# Altium schematic sheet EVB-ANNA-B5_SCHEM_0001_Power.SchDoc
size A3; Date: 7/24/2020; CompanyName: U-blox; DrawnBy: EMOO; Engineer: EMOO; Organization: U-blox; Address1: 3950 Fairview Industrial Dr SE #100; Address2: Salem, OR 97302; DocumentNumber: 2; SheetNumber: 2; SheetTotal: 8; SheetSize: B; SheetTitle: Power
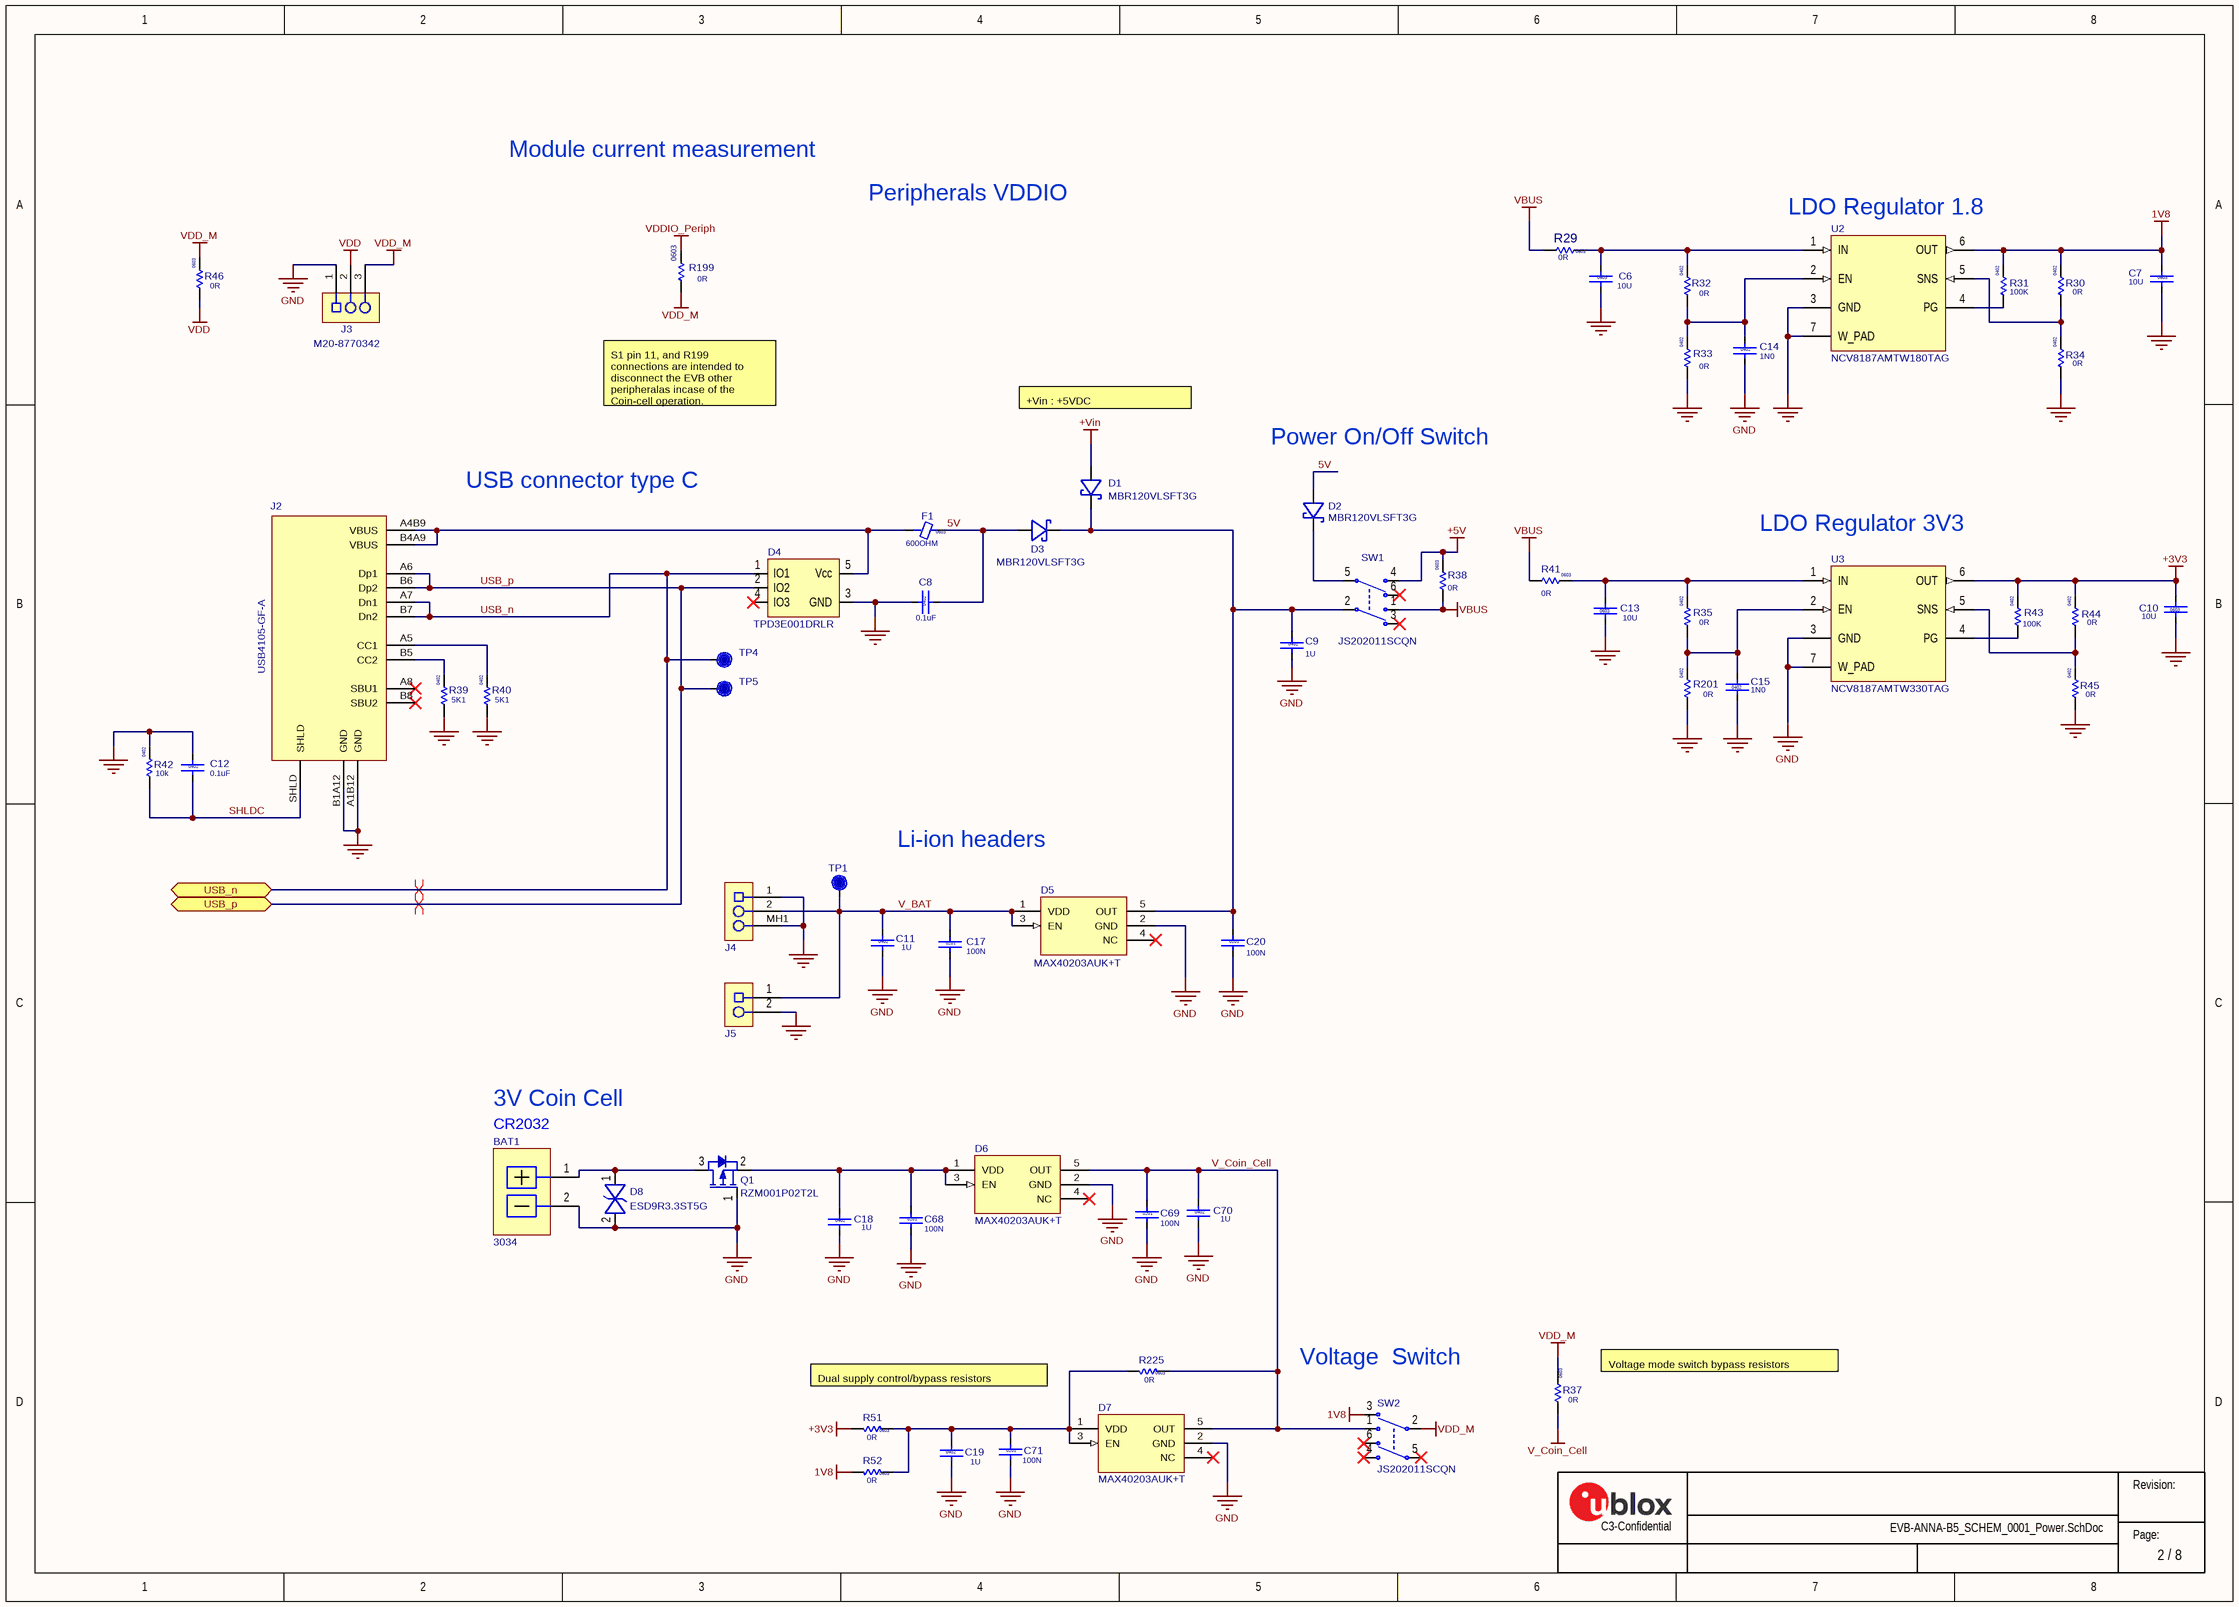
[diagram p0: EVB-ANNA-B5_SCHEM_0001_Power.SchDoc]

## Parts
BAT1  UBXH03-0000009  [3034]  (value not drawn)
C6  value 10U  Size: 0603  [CAP_0603_1750Lx950Wx850H_600x1000Pad_900G_FLX]  (hidden comment: UBXH01-0000310)
C7  value 10U  Size: 0603  [CAP_0603_1750Lx950Wx850H_600x1000Pad_900G_FLX]  (hidden comment: UBXH01-0000310)
C8  value 0.1uF  Size: 0402  [Cap 0402 HD]  (hidden comment: 120-00016)
C9  value 1U  Size: 0402  [Cap 0402 HD]  (hidden comment: UBXH01-0000248)
C10  value 10U  Size: 0603  [CAP_0603_1750Lx950Wx850H_600x1000Pad_900G_FLX]  (hidden comment: UBXH01-0000310)
C11  value 1U  Size: 0402  [Cap 0402 HD]  (hidden comment: UBXH01-0000248)
C12  value 0.1uF  Size: 0402  [Cap 0402 HD]  (hidden comment: 120-00016)
C13  value 10U  Size: 0603  [CAP_0603_1750Lx950Wx850H_600x1000Pad_900G_FLX]  (hidden comment: UBXH01-0000310)
C14  value 1N0  Size: 0402  [Cap 0402 HD]  (hidden comment: UBXH01-0000013)
C15  value 1N0  Size: 0402  [Cap 0402 HD]  (hidden comment: UBXH01-0000013)
C17  value 100N  Case/Package: 0201  [Cap 0201 HD]  (hidden comment: CAP CER X5R 0201 100N 10% 25V)
C18  value 1U  Size: 0402  [Cap 0402 HD]  (hidden comment: UBXH01-0000248)
C19  value 1U  Size: 0402  [Cap 0402 HD]  (hidden comment: UBXH01-0000248)
C20  value 100N  Case/Package: 0201  [Cap 0201 HD]  (hidden comment: CAP CER X5R 0201 100N 10% 25V)
C68  value 100N  Case/Package: 0201  [Cap 0201 HD]  (hidden comment: CAP CER X5R 0201 100N 10% 25V)
C69  value 100N  Case/Package: 0201  [Cap 0201 HD]  (hidden comment: CAP CER X5R 0201 100N 10% 25V)
C70  value 1U  Size: 0402  [Cap 0402 HD]  (hidden comment: UBXH01-0000248)
C71  value 100N  Case/Package: 0201  [Cap 0201 HD]  (hidden comment: CAP CER X5R 0201 100N 10% 25V)
D1  Manufacturer Part Number 1: MBR120VLSFT3G  [SOD-123F_U]  (hidden comment: 110-00005)
D2  Manufacturer Part Number 1: MBR120VLSFT3G  [SOD-123F_U]  (hidden comment: 110-00005)
D3  Manufacturer Part Number 1: MBR120VLSFT3G  [SOD-123F_U]  (hidden comment: 110-00005)
D4  Manufacturer P/N: TPD3E001DRLR  [SOT-553]  (hidden comment: 110-00018)
D5  Manufacturer Part Number 1: MAX40203AUK+T  [SOT-23-5_2]  (hidden comment: UBXH12-0000539)
D6  Manufacturer Part Number 1: MAX40203AUK+T  [SOT-23-5_2]  (hidden comment: UBXH12-0000539)
D7  Manufacturer Part Number 1: MAX40203AUK+T  [SOT-23-5_2]  (hidden comment: UBXH12-0000539)
D8  Manufacturer P/N: ESD9R3.3ST5G  [SOD-923]  (hidden comment: UBXH07-0000034)
F1  value 600OHM  Size: 0603  [IND_0603_1750Lx950Wx1050H_600x800Pad_800G_FLX]  (hidden comment: UBXH08-0000001)
J2  value USB4105-GF-A  [USB4105-GF-A]  (hidden comment: UBXH04-0000785)
J3  Manufacturer P/N: M20-8770342  [HDR-0.1P-3Pin-1Row-SMT]  (hidden comment: UBXH04-0000792)
J4  UBXH04-0000791  [B2B-PH-SM4-TB]  (value not drawn)
J5  UBXH04-0000026  [HDR-0.1P-2PIN-TH]  (value not drawn)
Q1  Manufacturer Part Number 1: RZM001P02T2L  [SOT-723]  (hidden comment: 140-00005)
R29  value 0R  Size: 0603  [RES_0603_1700Lx950Wx600H_600x1000Pad_800G_FLX]  (hidden comment: UBXH18-0003001)
R30  value 0R  Size: 0402  [RES 0402 HD]  (hidden comment: UBXH18-0003002)
R31  value 100K  Size: 0402  [RES 0402 HD]  (hidden comment: UBXH18-0000005)
R32  value 0R  Size: 0402  [RES 0402 HD]  (hidden comment: UBXH18-0003002)
R33  value 0R  Size: 0402  [RES 0402 HD]  (hidden comment: UBXH18-0003002)
R34  value 0R  Size: 0402  [RES 0402 HD]  (hidden comment: UBXH18-0003002)
R35  value 0R  Size: 0402  [RES 0402 HD]  (hidden comment: UBXH18-0003002)
R37  value 0R  Size: 0603  [RES_0603_1700Lx950Wx600H_600x1000Pad_800G_FLX]  (hidden comment: UBXH18-0003001)
R38  value 0R  Size: 0603  [RES_0603_1700Lx950Wx600H_600x1000Pad_800G_FLX]  (hidden comment: UBXH18-0003001)
R39  value 5K1  Size: 0402  [RES 0402 HD]  (hidden comment: UBXH18-0008066)
R40  value 5K1  Size: 0402  [RES 0402 HD]  (hidden comment: UBXH18-0008066)
R41  value 0R  Size: 0603  [RES_0603_1700Lx950Wx600H_600x1000Pad_800G_FLX]  (hidden comment: UBXH18-0003001)
R42  value 10k  Size: 0402  [RES 0402 HD]  (hidden comment: 180-00024)
R43  value 100K  Size: 0402  [RES 0402 HD]  (hidden comment: UBXH18-0000005)
R44  value 0R  Size: 0402  [RES 0402 HD]  (hidden comment: UBXH18-0003002)
R45  value 0R  Size: 0402  [RES 0402 HD]  (hidden comment: UBXH18-0003002)
R46  value 0R  Size: 0603  [RES_0603_1700Lx950Wx600H_600x1000Pad_800G_FLX]  (hidden comment: UBXH18-0003001)
R51  value 0R  Size: 0603  [RES_0603_1700Lx950Wx600H_600x1000Pad_800G_FLX]  (hidden comment: UBXH18-0003001)
R52  value 0R  Size: 0603  [RES_0603_1700Lx950Wx600H_600x1000Pad_800G_FLX]  (hidden comment: UBXH18-0003001)
R199  value 0R  Size: 0603  [RES_0603_1700Lx950Wx600H_600x1000Pad_800G_FLX]  (hidden comment: UBXH18-0003001)
R201  value 0R  Size: 0402  [RES 0402 HD]  (hidden comment: UBXH18-0003002)
R225  value 0R  Size: 0603  [RES_0603_1700Lx950Wx600H_600x1000Pad_800G_FLX]  (hidden comment: UBXH18-0003001)
SW1  Manufacturer P/N: JS202011SCQN  [SW_Slide_DPDT_JS202011SCQN]  (hidden comment: UBXH19-0000050)
SW2  Manufacturer P/N: JS202011SCQN  [SW_Slide_DPDT_JS202011SCQN]  (hidden comment: UBXH19-0000050)
TP1  TP10R  [TP10R]  (value not drawn)
TP4  TP10R  [TP10R]  (value not drawn)  (no BOM)
TP5  TP10R  [TP10R]  (value not drawn)  (no BOM)
U2  Manufacturer Part Number 1: NCV8187AMTW180TAG  [DFN0.65P-6Pin_W-Pad]  (hidden comment: UBXH43-0000004)
U3  Manufacturer Part Number 1: NCV8187AMTW330TAG  [DFN0.65P-6Pin_W-Pad]  (hidden comment: UBXH43-0000003)

## Ports
USB_n (bidir), USB_p (bidir)

## Nets
1V8: C7.1 R30.2 R31.2 R52.2 SW2.3(N.C-1) U2.6(OUT)
+3V3: C10.1 R43.2 R44.2 R51.2 U3.6(OUT)
+5V: R38.2 SW1.4(N.O-2)
+Vin: D1.A(Anode)
GND: BAT1.2 C6.2 C7.2 C8.1 C9.2 C10.2 C11.2 C12.1 C13.2 C14.2 C15.1 C17.2 C18.2 C19.2 C20.2 C68.2 C69.2 C70.2 C71.2 D4.3(GND) D5.2(GND) D6.2(GND) D7.2(GND) D8.2 J2.A1B12(GND) J2.B1A12(GND) J3.1 J4.1 J4.MH1 J5.2 Q1.1(G) R33.1 R34.1 R39.1 R40.1 R42.2 R45.1 R201.1 U2.3(GND) U2.7(W_PAD) U3.3(GND) U3.7(W_PAD)
V_Coin_Cell: C69.1 C70.1 D6.5(OUT) D7.5(OUT) R37.2 R225.1 SW2.1(N.O-1)
VBUS: R29.1 R38.1 R41.1 SW1.1(N.O-1)
VDD: J3.2 R46.1
VDD_M: J3.3 R37.1 R46.2 R199.1 SW2.2(COM-1)
VDDIO_Periph: R199.2
5V: C8.2 D2.A(Anode) D3.A(Anode) F1.2
SHLDC: C12.2 J2.SHLD R42.1
USB_n: D4.1(IO1) J2.A7(Dn1) J2.B7(Dn2) TP4.1 ; port USB_n
USB_p: D4.2(IO2) J2.A6(Dp1) J2.B6(Dp2) TP5.1 ; port USB_p
V_BAT: C11.1 C17.1 D5.1(VDD) D5.3(EN) J4.2 J5.1 TP1.1
NetBAT1_1: BAT1.1 D8.1 Q1.3(D)
NetC6_1: C6.1 R29.2 R32.2 U2.1(IN)
NetC9_1: C9.1 C20.1 D1.C(Cathode) D3.C(Cathode) D5.5(OUT) SW1.2(COM-1)
NetC13_1: C13.1 R35.2 R41.2 U3.1(IN)
NetC14_1: C14.1 R32.1 R33.2 U2.2(EN)
NetC15_2: C15.2 R35.1 R201.2 U3.2(EN)
NetC18_1: C18.1 C68.1 D6.1(VDD) D6.3(EN) Q1.2(S)
NetC19_1: C19.1 C71.1 D7.1(VDD) D7.3(EN) R51.1 R52.1 R225.2
NetD2_C: D2.C(Cathode) SW1.5(COM-2)
NetD4_5: D4.5(Vcc) F1.1 J2.A4B9(VBUS) J2.B4A9(VBUS)
NetJ2_A5: J2.A5(CC1) R40.2
NetJ2_B5: J2.B5(CC2) R39.2
NetR30_1: R30.1 R34.2 U2.5(SNS)
NetR31_1: R31.1 U2.4(PG)
NetR43_1: R43.1 U3.4(PG)
NetR44_1: R44.1 R45.2 U3.5(SNS)

Not connected (* = marked no-connect by the designer): D4 4(IO3)*; D5 4(NC)*; D6 4(NC)*; D7 4(NC)*; J2 A8(SBU1)* B8(SBU2)*; SW1 3(N.C-1)* 6(N.C-2)*; SW2 4(N.O-2)* 5(COM-2)* 6(N.C-2)*

## Layout directives
differential pair: USB_n, USB_p

## Notes on the sheet
- Module current measurement
- (near R199) Peripherals VDDIO
- (near U2) LDO Regulator 1.8
- S1 pin 11, and R199 connections are intended to disconnect the EVB other peripheralas incase of the Coin-cell operation.
- +Vin : +5VDC
- (near D2) Power On/Off Switch
- (near J2) USB connector type C
- (near U3) LDO Regulator 3V3
- Li-ion headers
- 3V Coin Cell
- (near BAT1) CR2032
- Dual supply control/bypass resistors
- (near SW2) Voltage  Switch
- (near R37) Voltage mode switch bypass resistors
- Revision:
- C3-Confidential
- Page:

## Library data of the parts
BAT1 = UBXH03-0000009: BATTERY HOLDER COIN SMT CR2020 CR2025 CR2032 KEYSTONE 3034; Manufacturer: Keystone Electronics Corporation; Value: 3034; Editor: eric.moog; Env: ROHS; Permitted Use: Support Products; Perferred: PREF; Mfg P/N Status: Active; Mfg P/N Split: 100; Mfg P/N Released: No; Manufacturer P/N: 3034; Part Number: UBXH03-0000009; Min Operating Temp: -55°C; Max Operating Temp: 125°C; Part Type: Battery; UBX Wiki: https://wiki.u-blox.com/bin/view/Operations/PartDetails?index=38836; RefDes: BT; Mfg P/N Datasheet: https://wiki.u-blox.com/bin/view/Generic/Docs/DocumentSummary?index=38835
C6 C7 C10 C13 = UBXH01-0000310: CAP CER X7R 0603 10U 20% 10V; Manufacturer: Murata Manufacturing Company, Ltd.; Manufacturer P/N: GRM188Z71A106MA73; Editor: michael.hein; Released by: martin.grasse; Env: ROHS; Permitted Use: Volume Products; Perferred: PREF; Mfg P/N Status: Active; Mfg P/N Split: 100; Mfg P/N Released: Yes; Part Number: UBXH01-0000310; Tolerance: 20%; Max Voltage: 10V; Min Operating Temp: -55°C; Max Operating Temp: 125°C; Part Type: Capacitor; Release Data: 2017-02-09T11:14:05; UBX Wiki: https://wiki.u-blox.com/bin/view/Operations/PartDetails?index=26280; RefDes: C; Mfg P/N Datasheet: https://wiki.u-blox.com/bin/view/Generic/Docs/DocumentSummary?index=26282; Manufacturer 2: Murata Manufacturing Company, Ltd.; Manufacturer P/N 2: GRM188Z71A106KA73; Mfg P/N Status 2: Active; Mfg P/N Split 2: 0; Mfg P/N Released 2: Yes; Mfg P/N Datasheet 2: https://wiki.u-blox.com/bin/view/Generic/Docs/DocumentSummary?index=28416
  C10 C13: Case/Package: 0x0y
C8 C12 = 120-00016: Cap, Ceramic 0.1uF 10V 10% X5R 0402; Part Name: CAP CER 0.1UF 10V 10% X5R 0402; Part_Type: Ceramic Capacitor; Manufacturer: Murata Electronics North America; Manufacturer P/N: GRM155R61A104KA01J; Item_Phase: Production; Component Mounting Type: SMT; Tolerance: +/- 10%; Use in new designs: Yes; Part Number: 120-00016; Revision: 0A; Supplier 1: Digi-Key; Supplier Part Number 1: 490-6297-1-ND; Manufacturer 2: Yageo; Manufacturer P/N 2: CC0402KRX5R6BB104; Supplier 2: Digi-Key; Supplier Part Number 2: 311-1336-1-ND; Arena Link: https://app.bom.com/a/GYHPV2L2L43KRMBK?v=spec.summary; Height: 0.55mm; Pins: 2; Temperature Coefficient: X5R; Voltage: 10V
C9 C11 C18 C19 C70 = UBXH01-0000248: CAP CER X5R 0402 1U 10% 10V; Manufacturer: Murata Manufacturing Company, Ltd.; Manufacturer P/N: GRM155R61C105KA12; Editor: michael.hein; Released by: igor.shevchenko; Env: ROHS; Permitted Use: Volume Products; Perferred: PREF; Mfg P/N Status: Active; Mfg P/N Split: 100; Mfg P/N Released: Yes; Part Number: UBXH01-0000248; Tolerance: 10%; Max Voltage: 10V; Min Operating Temp: -40°C; Max Operating Temp: 85°C; Part Type: Capacitor; Release Data: 2016-03-16T11:26:35; UBX Wiki: https://wiki.u-blox.com/bin/view/Operations/PartDetails?index=24378; RefDes: C; Mfg P/N Datasheet: https://wiki.u-blox.com/bin/view/Generic/Docs/DocumentSummary?index=29581; Manufacturer 2: TDK Corporation; Manufacturer P/N 2: C1005X5R1E105K050BC; Mfg P/N Status 2: Active; Mfg P/N Split 2: 0; Mfg P/N Released 2: Yes; Mfg P/N Datasheet 2: https://wiki.u-blox.com/bin/view/Generic/Docs/DocumentSummary?index=28058; Manufacturer 3: Samsung Electro-Mechanics; Manufacturer P/N 3: CL05A105KA5NQNC; Mfg P/N Status 3: Active; Mfg P/N Split 3: 0; Mfg P/N Released 3: Yes; Mfg P/N Datasheet 3: https://wiki.u-blox.com/bin/view/Generic/Docs/DocumentSummary?index=28056
  C19: Case/Package: 0x0y
C14 C15 = UBXH01-0000013: CAP CER X7R 0402 1N0 10% 50V; Manufacturer: Murata Manufacturing Company, Ltd.; Manufacturer P/N: GRM155R71H102KA01; Editor: massimo.vlacci; Released by: dario.antonaz; Env: ROHS; Permitted Use: Volume Products; Perferred: PREF; Mfg P/N Status: NRND; Mfg P/N Split: 100; Mfg P/N Released: Yes; Part Number: UBXH01-0000013; Tolerance: 10%; Max Voltage: 50V; Part Type: Capacitor; Release Data: 2015-04-23T14:26:43; UBX Wiki: https://wiki.u-blox.com/bin/view/Operations/PartDetails?index=8466; RefDes: C; Mfg P/N Datasheet: https://wiki.u-blox.com/bin/view/Generic/Docs/DocumentSummary?index=22572; Case/Package: 0x0y
C17 C20 C68 C69 C71 = UBXCMP-CAP-00178-4: Critical Part: No; Part Number: UBXH01-0000241; PLM Revision: A; Component Mounting Type: SMT; Owner: Dario Antonaz (null); Pack Type: DEFAULT; Volume Use: Yes; Environmental Grade: RoHS; PLM Lifecycle Phase: Full Production; JEDEC Type: S0201_C; Max Operating Temperature: 85°C; Tolerance: 10%; Part: CAP; Temperature Coefficient: X5R; Maximum Voltage: 25V; Use in new designs: Yes; Min Operating Temperature: -40°C; Part Status: Preferred; Automotive: No
D1-D3 = 110-00005: Diode, Schottky, 20V 1A SOD-123F, 340mV Vf @ 1A / MBR120VLSFT3G; Manufacturer 1: ON Semiconductor; Part Name: Diode Schottky 20V 1A SOD-123FL; Body Size: None; Item Phase: In Production; MFG Package: SOD-123FL; Use in new designs: Yes; Part Number: 110-00005; Supplier 1: Digi-Key; Supplier Part Number 1: MBR120VLSFT3GOSCT-ND; Manufacturer 2: None; Manufacturer Part Number 2: None; Supplier 2: None; Supplier Part Number 2: None; Current: 1A; Height: 0.98mm; Max Operating Temp: 125; Min Operating Temp: -65; Pins: 2; Revision: 0B; Voltage: 20V; UBX Code: None
D4 = 110-00018: LOW-CAPACITANCE 3-CHANNEL ESD-PROTECTION ARRAY; Part Name: TVS Diode, 3CH High Speed ESD; Part_Type: Diode; Manufacturer: Texas Instruments; Item_Phase: Production; Body Size: 1.6mm x 1.2mm; Component Mounting Type: SMT; Diode Type: TVS; Use in new designs: Yes; Voltage: 5V; Part Number: 110-00018; Revision: 0A; Supplier 1: Digi-Key; Supplier Part Number 1: 296-21885-1-ND; Arena Link: https://app.bom.com/a/UCV39GZGZIHX50AE?v=spec.summary; Height: .55mm; MFG Package: SOT-553; Package Type: SOT; Pins: 5
D5-D7 = UBXH12-0000539: IDEAL DIODE OR CONTROLLER SOURCE SELECTOR SWITCH P-CHANNEL 1:1 SOT-23-5 5.5V 1A; Part Name: IC IDEAL DIODE LDO 1.2-5.5V 1.0A SOT-23-5; Manufacturer 1: Maxim; Item_Phase: Preliminary; Body Size: 2.8mm x 2.9mm; Component Mounting Type: SMT; Current: 1.0A; SMT Pitch: 0.95mm; Use in new designs: Yes; Value: MAX40203AUK+T; Editor: eric.moog; Env: ROHS; Permitted Use: Support Products; Mfg P/N Status: Active; Mfg P/N Split: 100; Mfg P/N Released: No; Part Number: UBXH12-0000539; Part_Type: Ideal Diode; Supplier 1: Digi-Key; Supplier Part Number 1: 175-MAX40203AUK+TTR-ND; Height: 1.25; MFG Package: SOT-23-5; Package Type: SOT-23-5; Pins: 5; Voltage: 5.5V; HelpURL: https://datasheets.maximintegrated.com/en/ds/MAX40203.pdf; Max Voltage: 5.5V; Max Current: 1A; Part Type: PMIC; UBX Wiki: https://wiki.u-blox.com/bin/view/Operations/PartDetails?index=38597; Perferred: N/A; RefDes: U; Manufacturer: Maxim; Manufacturer P/N: MAX40203AUK+T; Mfg P/N Datasheet: https://wiki.u-blox.com/bin/view/Generic/Docs/DocumentSummary?index=38598
D8 = UBXH07-0000034: ESD PROTECTION DIODE ULTRA LOW LEAKAGE SOD923 ON SEMI 3V3; Manufacturer: ON Semiconductor; Editor: pierpaolo.arban; Released by: dario.antonaz; Env: ROHS; Permitted Use: Support Products; Perferred: PREF; Mfg P/N Status: Active; Mfg P/N Split: 100; Mfg P/N Released: Yes; Part Number: UBXH07-0000034; Value: 3V3; Part Type: Diode; Release Data: 2015-04-23T14:51:11; UBX Wiki: https://wiki.u-blox.com/bin/view/Operations/PartDetails?index=22447; RefDes: D; Mfg P/N Datasheet: https://wiki.u-blox.com/bin/view/Generic/Docs/DocumentSummary?index=22449
F1 = UBXH08-0000001: FERRITE BEAD 0603 600 OHM AT 100MHZ 600OHM 500mA; Manufacturer: TDK Corporation; Manufacturer P/N: MMZ1608B601C; Editor: daniel.hurni; Released by: martin.frauchiger; Env: ROHS; Permitted Use: Support Products; Perferred: PREF; Mfg P/N Status: Active; Mfg P/N Split: 100; Mfg P/N Released: Yes; Part Number: UBXH08-0000001; Max Current: 500mA; Min Operating Temp: -40°C; Max Operating Temp: 125°C; Part Type: Ferrite; Release Data: 2009-12-02T10:18:36; UBX Wiki: https://wiki.u-blox.com/bin/view/Operations/PartDetails?index=7960; RefDes: FB; Mfg P/N Datasheet: https://wiki.u-blox.com/bin/view/Generic/Docs/DocumentSummary?index=7941
J2 = UBXH04-0000785: CONN RCP USB2.0 TYP C 24P SMD RA 20V 6.25A; Manufacturer 1: GCT; Body Size: 7.3mm x 8.9mm; Item Phase: Unreleased; SMT Pitch: 0.5mm; Use in new designs: Yes; Voltage: <20V DC; UBX Code: None; Editor: eric.moog; Env: ROHS; Permitted Use: Support Products; Perferred: PREF; Mfg P/N Status: Active; Mfg P/N Split: 100; Mfg P/N Released: No; Part Number: UBXH04-0000785; Manufacturer Part Number 1: USB4105-GF-A; Height: 3.31mm; Max Operating Temp: 85°C; Min Operating Temp: -40°C; Pins: 8; Revision: None; Size: Other; Manufacturer 2: None; Manufacturer Part Number 2: None; Supplier 2: None; Supplier Part Number 2: None; Max Voltage: 20V; Max Current: 6.25A; Part Type: Connector; UBX Wiki: https://wiki.u-blox.com/bin/view/Operations/PartDetails?index=38207; RefDes: J; Manufacturer: GCT; Manufacturer P/N: USB4105-GF-A; Mfg P/N Datasheet: https://wiki.u-blox.com/bin/view/Generic/Docs/DocumentSummary?index=38208
J3 = UBXH04-0000792: 1-ROW SMD CONN 100MIL GRID 3 -PIN 100V 3A; Manufacturer: HARWiN; Value: M20-8770342; Editor: eric.moog; Env: ROHS; Permitted Use: Support Products; Mfg P/N Status: Active; Mfg P/N Split: 100; Mfg P/N Released: No; Part Number: UBXH04-0000792; Max Voltage: 100V; Max Current: 3A; Min Operating Temp: -40°C; Max Operating Temp: 105°C; Part Type: Connector; UBX Wiki: https://wiki.u-blox.com/bin/view/Operations/PartDetails?index=38569; Perferred: N/A; RefDes: J; Mfg P/N Datasheet: https://wiki.u-blox.com/bin/view/Generic/Docs/DocumentSummary?index=28457
J4 = UBXH04-0000791: CONN 1-ROW SMT 2.0MM GRID 2-PIN VERT 100V 2A; Part Name: Conn, SMT, 0.079" Pitch, 2 Pin, Vert, Black; Manufacturer: JST; Item Phase: In Production; Use in new designs: Yes; Voltage: None; Value: B2B-PH-SM4-TB; Editor: eric.moog; Env: ROHS; Permitted Use: Support Products; Mfg P/N Status: Active; Mfg P/N Split: 100; Mfg P/N Released: No; Part Number: UBXH04-0000791; Manufacturer Part Number 1: B2B-PH-SM4-TB; Supplier 1: None; Supplier Part Number 1: None; Diameter: None; Height: 6.5mm; Max Operating Temp: 85°C; Min Operating Temp: -30°C; Pins: 2; Revision: 0A; UBX Code: None; Manufacturer 2: None; Manufacturer Part Number 2: None; Supplier 2: None; Supplier Part Number 2: None; Manufacturer P/N: B2B-PH-SM4-TB; Max Voltage: 100V; Max Current: 2A; Part Type: Connector; UBX Wiki: https://wiki.u-blox.com/bin/view/Operations/PartDetails?index=38567; Perferred: N/A; RefDes: J; Mfg P/N Datasheet: https://wiki.u-blox.com/bin/view/Generic/Docs/DocumentSummary?index=35463
J5 = UBXH04-0000026: 1-ROW TH-PCB SOCKETS 100MIL GRID 2-PIN 0.64MM SQUARE POLARIZE; Manufacturer P/N: M20-9990245; Manufacturer: HARWiN; Value: M20-9990245; Editor: roland.rust; Released by: alvaro.nussbaum; Env: ROHS; Permitted Use: Internal Use; Perferred: PREF; Mfg P/N Status: Active; Mfg P/N Split: 100; Mfg P/N Released: Yes; Part Number: UBXH04-0000026; Part Type: Connector; Release Data: 2015-06-04T16:45:09; UBX Wiki: https://wiki.u-blox.com/bin/view/Operations/PartDetails?index=10937; RefDes: J
Q1 = 140-00005: P-MOSFET, 20V, 100mA, SOT-723-3; Part Name: MOSFET P-CH 20V 0.1A VMT3; Manufacturer 1: Rohm Semiconductor; Body Size: 1.2mm x 0.8mm; Transistor Type: P-Channel; Use in new designs: Yes; Item Phase: In Production; Thermal Pad: No; UBX Code: None; Part Number: 140-00005; Current: 100mA; Height: 0.5mm; MFG Package: SOT-723; Pins: 3; Voltage: 20V; Max Operating Temp: 150; Min Operating Temp: -55; Revision: 0B; Manufacturer 2: Toshiba Semiconductor and Storage; Supplier 1: Digi-Key; Supplier Part Number 1: RZM001P02T2LCT-ND; Manufacturer Part Number 2: SSM3J35MFV,L3F; Supplier 2: Digi-Key; Supplier Part Number 2: SSM3J35MFVL3FCT-ND
R29 R37 R38 R41 R46 R51 R52 R199 R225 = UBXH18-0003001: RES THICK FILM CHIP 0603 0R 0 100mW; Manufacturer: YAGEO; Manufacturer P/N: RC0603JR-070RL; Tolerance: 0; Editor: martin.frauchiger; Env: ROHS; Permitted Use: Volume Products; Perferred: PREF; Mfg P/N Status: Active; Mfg P/N Split: 100; Mfg P/N Released: Yes; Part Number: UBXH18-0003001; Max Power: 100mW; Part Type: Resistor; Released by: martin.frauchiger; Release Data: 2005-07-14T10:55:51; UBX Wiki: https://wiki.u-blox.com/bin/view/Operations/PartDetails?index=6609; RefDes: R
  R199: Case/Package: 0x0y
R30 R32 R44 R45 R201 = UBXH18-0003002: RES THICK FILM CHIP 0402 0R 0 100mW; Manufacturer: KOA; Manufacturer P/N: RK73Z1ETTP; Tolerance: 0; Editor: charlotte.biber; Released by: peter.mueller; Env: ROHS; Permitted Use: Volume Products; Perferred: PREF; Mfg P/N Status: NRND; Mfg P/N Split: 100; Mfg P/N Released: Yes; Part Number: UBXH18-0003002; Max Power: 100mW; Part Type: Resistor; Release Data: 2012-06-05 09:49:55.978616; UBX Wiki: https://wiki.u-blox.com/bin/view/Operations/PartDetails?index=6611; RefDes: R; Manufacturer 2: YAGEO; Manufacturer P/N 2: 2322_705_91001_L; Mfg P/N Status 2: NRND; Mfg P/N Split 2: 0; Mfg P/N Released 2: Yes
R31 R43 = UBXH18-0000005: RES THICK FILM CHIP 0402 100K 1% 63mW; Manufacturer: KOA; Manufacturer P/N: RK73H1ETTP1003F; Editor: dario.antonaz; Released by: sandro.sestan; Env: ROHS; Permitted Use: Volume Products; Mfg P/N Status: Active; Mfg P/N Split: 100; Mfg P/N Released: Yes; Part Number: UBXH18-0000005; Tolerance: 1%; Max Power: 63mW; Part Type: Resistor; Release Data: 2009-11-30T11:05:22; UBX Wiki: https://wiki.u-blox.com/bin/view/Operations/PartDetails?index=8114; Perferred: N/A; RefDes: R; Mfg P/N Split 2: 0; Mfg P/N Released 2: Yes; Mfg P/N Datasheet: https://wiki.u-blox.com/bin/view/Generic/Docs/DocumentSummary?index=8222
  R31: Manufacturer 2: YAGEO; Manufacturer P/N 2: RC0402FR-07100KL; Mfg P/N Status 2: Active; Case/Package: 0x0y; Mfg P/N Datasheet 2: https://wiki.u-blox.com/bin/view/Generic/Docs/DocumentSummary?index=29373; Manufacturer 3: ROHM; Manufacturer P/N 3: MCR01MZPF1003; Mfg P/N Status 3: Obsolete; Mfg P/N Split 3: 0; Mfg P/N Released 3: Yes; Mfg P/N Datasheet 3: https://wiki.u-blox.com/bin/view/Generic/Docs/DocumentSummary?index=8186
  R43: Manufacturer 2: ROHM; Manufacturer P/N 2: MCR01MZPF1003; Mfg P/N Status 2: Obsolete; Mfg P/N Datasheet 2: https://wiki.u-blox.com/bin/view/Generic/Docs/DocumentSummary?index=8186
R33-R35 = UBXH18-0003002: RES THICK FILM CHIP 0402 0R 0 100mW; Manufacturer: KOA; Manufacturer P/N: RK73Z1ETTD; Tolerance: 0; Editor: charlotte.biber; Released by: peter.mueller; Env: ROHS; Permitted Use: Volume Products; Perferred: PREF; Mfg P/N Status: NRND; Mfg P/N Split: 100; Mfg P/N Released: Yes; Part Number: UBXH18-0003002; Max Power: 100mW; Part Type: Resistor; Release Data: 2012-06-05T09:49:55; UBX Wiki: https://wiki.u-blox.com/bin/view/Operations/PartDetails?index=6611; RefDes: R; Manufacturer 2: YAGEO; Manufacturer P/N 2: 2322_705_91001_L; Mfg P/N Status 2: Obsolete; Mfg P/N Split 2: 0; Mfg P/N Released 2: Yes
R39 R40 = UBXH18-0008066: RES THICK FILM CHIP 0402 5K1 5% 100mW; Manufacturer: Panasonic; Manufacturer P/N: ERJ-2GEJ512X; Editor: alvaro.nussbaum; Released by: roland.rust; Env: ROHS; Permitted Use: Internal Use; Perferred: NONPREF; Mfg P/N Status: Active; Mfg P/N Split: 100; Mfg P/N Released: No; Part Number: UBXH18-0008066; Tolerance: 5%; Max Power: 100mW; Part Type: Resistor; Release Data: 2016-02-11T15:22:01; UBX Wiki: https://wiki.u-blox.com/bin/view/Operations/PartDetails?index=6972; RefDes: R
R42 = 180-00024: Resistor 10k ohm 1% 1/16W, 0402; Part Name: RES SMD 10K OHM 1% 1/16W 0402; Manufacturer 1: Samsung Electro-Mechanics America, Inc; Manufacturer Part Number 1: RC1005F103CS; Tolerance: +/- 1%; Use in new designs: Yes; Item Phase: In Production; UBX Code: None; Part Number: 180-00024; Revision: 0E; Supplier 1: Digi-Key; Supplier Part Number 1: 1276-3431-1-ND; Manufacturer 2: Hong Kong Resistors Manufactory; Height: 0.4mm; Pins: 2; Power: 1/16W; Voltage: N/A; Manufacturer Part Number 2: RCT0210KFLF; Supplier 2: None; Supplier Part Number 2: None; Max Operating Temp: 155; Min Operating Temp: -55
SW1 SW2 = UBXH19-0000050: 2 WAY ON-ON SUB-MINIATURE SLIDE SWITCH SMD JS SERIES; Manufacturer: C&K Components; Value: JS202011SCQN; Editor: andre.pick; Released by: martin.pilik; Env: ROHS; Permitted Use: Support Products; Perferred: PREF; Mfg P/N Status: Active; Mfg P/N Split: 100; Mfg P/N Released: Yes; Part Number: UBXH19-0000050; Min Operating Temp: -40°C; Max Operating Temp: 85°C; Part Type: Switch; Release Data: 2022-06-09T16:59:15; UBX Wiki: https://wiki.u-blox.com/bin/view/Operations/PartDetails?index=36899; RefDes: S; Mfg P/N Datasheet: https://wiki.u-blox.com/bin/view/Generic/Docs/DocumentSummary?index=16625
TP1 TP4 TP5 = TP10R: Testpoint, Round 1.0mm Dia; Added By: Jeremy D; Part Number: TP10R; Size: 1.0mm; Height: 0; DNP: DNP; Checked By: Paul B
  TP1: Added Date: 2015-02-01; Checked Date: 2015-02-05
  TP4 TP5: Added Date: 2/1/2015; Checked Date: 2/5/2015
U2 = UBXH43-0000004: LDO REGULATOR 1.8V,LOW Iq, WDFNW6 2x2 MM PACKAGE 1200 mA; Manufacturer 1: ONSEMI Conductor; Manufacturer Split 1: 100; Part Phase: Unreleased; Environmental Grade: RoHS; Owner: Hozaifa Abdelgadir; Use in new designs: Yes; Volume Use: No; Maximum Current: 1.2A; Body Size: 2.10mm x 2.10 mm; Max Supply Voltage: 5.5V; Min Supply Voltage: 1.5; SMT Pitch: 0.65mm; Part Number: UBXH43-0000004; Automotive: No; ComponentLink1Description: Arena Link; ComponentLink1Url: https://app.bom.com/1J3MRFNPJL4CV8H3H3XG; Max Operating Temp: 150°C; Min Operating Temp: -40°C; Part Name: LDO REGULATOR 1.8V,LOW Iq, WDFNW6 2x2 MM PACKAGE 1200 mA; Part Status: Non-Preferred; Part Type: Regulator - Linear; Height: 0.8mm; Mounting Type: SMT; Output Voltage: 1.8V; Pins: 6; Single Source: No; Case/Package: WDFNW6 2x2; Thermal Pad: Yes
U3 = UBXH43-0000003: LDO REGULATOR 3.3V,LOW Iq, WDFNW6 2x2 MM, 0.65P PACKAGE 1200 mA; Manufacturer 1: ONSEMI Conductor; Manufacturer Split 1: 100; Part Name: LDO REGULATOR  3.3V,LOW Iq, WDFNW6 2x2 MM PACKAGE 1200 mA; Part Phase: Unreleased; Part Revision: 1; Environmental Grade: RoHS; Owner: Hozaifa Abdelgadir; Use in new designs: Yes; Volume Use: No; Maximum Current: 1.2A; Body Size: 2.1mmx2.1mm; Max Supply Voltage: 5.5V; Min Supply Voltage: 1.5V; SMT Pitch: 0.65mm; Part Number: UBXH43-0000003; Automotive: No; ComponentLink1Description: Arena Link; ComponentLink1Url: https://app.bom.com/R9TCH5DF9BU2LY72VT52; Max Operating Temp: 150°C; Min Operating Temp: -40°C; Part Status: Non-Preferred; Part Type: Regulator - Linear; Height: 0.8mm; Mounting Type: SMT; Output Voltage: 3.3V; Pins: 6; Single Source: No; Case/Package: WDFNW6 2x2; Thermal Pad: Yes